# Altium schematic sheet Sheet5.SchDoc
size A4
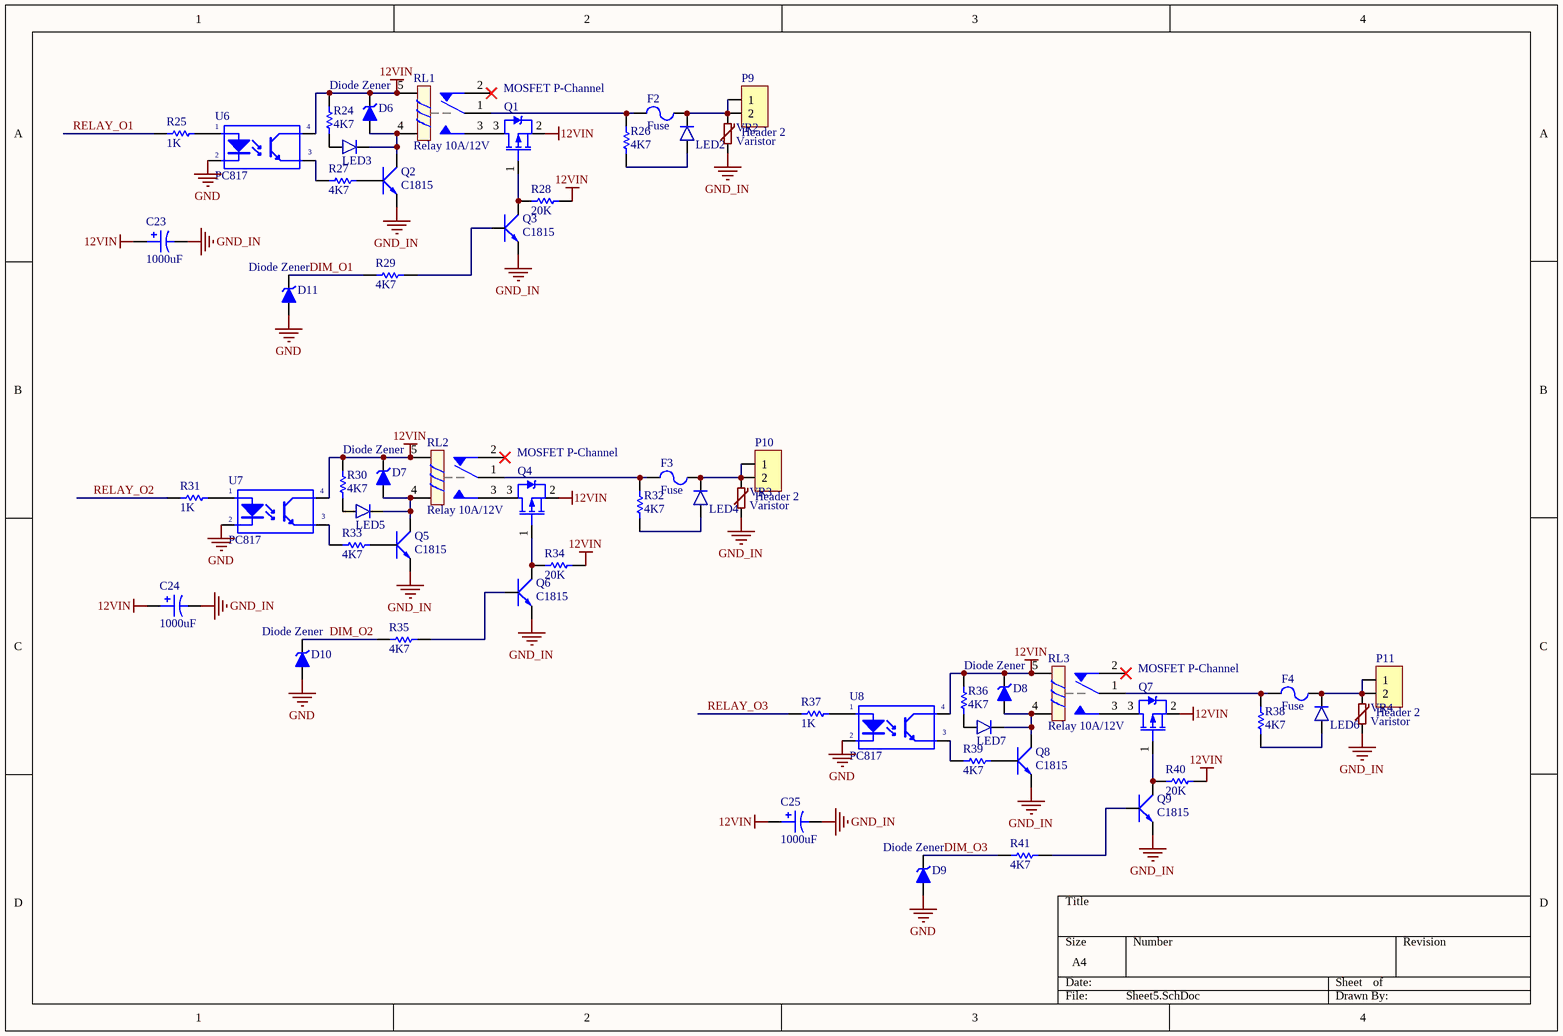
[diagram p0: Sheet5.SchDoc]

## Parts
C23  value 1000uF  [RADIAL E]  (hidden comment: Cap Pol)
C24  value 1000uF  [RADIAL E]  (hidden comment: Cap Pol)
C25  value 1000uF  [RADIAL E]  (hidden comment: Cap Pol)
D6  Diode Zener  [SOD-80]
D7  Diode Zener  [SOD-80]
D8  Diode Zener  [SOD-80]
D9  Diode Zener  [SOD-80]
D10  Diode Zener  [SOD-80]
D11  Diode Zener  [SOD-80]
F2  Fuse  [DCAR Fuse holder]
F3  Fuse  [DCAR Fuse holder]
F4  Fuse  [DCAR Fuse holder]
LED2  Led  [Led SMD 0805]  (value not drawn)
LED3  Led  [Led SMD 0805]  (value not drawn)
LED4  Led  [Led SMD 0805]  (value not drawn)
LED5  Led  [Led SMD 0805]  (value not drawn)
LED6  Led  [Led SMD 0805]  (value not drawn)
LED7  Led  [Led SMD 0805]  (value not drawn)
P9  Header 2  [HDR Domino 2]
P10  Header 2  [HDR Domino 2]
P11  Header 2  [HDR Domino 2]
Q1  MOSFET P-Channel  [TO-252 (DPAK)]
Q2  C1815  [SOT23B]
Q3  C1815  [SOT23B]
Q4  MOSFET P-Channel  [TO-252 (DPAK)]
Q5  C1815  [SOT23B]
Q6  C1815  [SOT23B]
Q7  MOSFET P-Channel  [TO-252 (DPAK)]
Q8  C1815  [SOT23B]
Q9  C1815  [SOT23B]
R24  4K7  [R 0805 (2012)]
R25  1K  [R 0805 (2012)]
R26  4K7  [R 0805 (2012)]
R27  4K7  [R 0805 (2012)]
R28  20K  [R 0805 (2012)]
R29  4K7  [R 0805 (2012)]
R30  4K7  [R 0805 (2012)]
R31  1K  [R 0805 (2012)]
R32  4K7  [R 0805 (2012)]
R33  4K7  [R 0805 (2012)]
R34  20K  [R 0805 (2012)]
R35  4K7  [R 0805 (2012)]
R36  4K7  [R 0805 (2012)]
R37  1K  [R 0805 (2012)]
R38  4K7  [R 0805 (2012)]
R39  4K7  [R 0805 (2012)]
R40  20K  [R 0805 (2012)]
R41  4K7  [R 0805 (2012)]
RL1  Relay 10A/12V  [RL_SPDT_10A]
RL2  Relay 10A/12V  [RL_SPDT_10A]
RL3  Relay 10A/12V  [RL_SPDT_10A]
U6  PC817  [SOP4 - PC817]
U7  PC817  [SOP4 - PC817]
U8  PC817  [SOP4 - PC817]
VR2  Varistor  [VARISTOR DISC 5MM/7MM]
VR3  Varistor  [VARISTOR DISC 5MM/7MM]
VR4  Varistor  [VARISTOR DISC 5MM/7MM]

## Nets
12VIN: C23.1 C24.1 C25.1 D6.2(K) D7.2(K) D8.2(K) Q1.2(S) Q4.2(S) Q7.2(S) R24.2 R28.2 R30.2 R34.2 R36.2 R40.2 RL1.5 RL2.5 RL3.5 U6.4(C) U7.4(C) U8.4(C)
GND: D9.1(A) D10.1(A) D11.1(A) U6.2(K) U7.2(K) U8.2(K)
GND_IN: C23.2 C24.2 C25.2 Q2.1(E) Q3.1(E) Q5.1(E) Q6.1(E) Q8.1(E) Q9.1(E) VR2.1 VR3.1 VR4.1
DIM_O1: D11.2(K) R29.1
DIM_O2: D10.2(K) R35.1
DIM_O3: D9.2(K) R41.1
RELAY_O1: R25.2
RELAY_O2: R31.2
RELAY_O3: R37.2
NetD6_1: D6.1(A) LED3.2(K) Q2.2(C) RL1.4
NetD7_1: D7.1(A) LED5.2(K) Q5.2(C) RL2.4
NetD8_1: D8.1(A) LED7.2(K) Q8.2(C) RL3.4
NetF2_1: F2.1 R26.2 RL1.1
NetF2_2: F2.2 LED2.2(K) P9.1 P9.2 VR2.2
NetF3_1: F3.1 R32.2 RL2.1
NetF3_2: F3.2 LED4.2(K) P10.1 P10.2 VR3.2
NetF4_1: F4.1 R38.2 RL3.1
NetF4_2: F4.2 LED6.2(K) P11.1 P11.2 VR4.2
NetLED2_1: LED2.1(A) R26.1
NetLED3_1: LED3.1(A) R24.1
NetLED4_1: LED4.1(A) R32.1
NetLED5_1: LED5.1(A) R30.1
NetLED6_1: LED6.1(A) R38.1
NetLED7_1: LED7.1(A) R36.1
NetQ1_1: Q1.1(G) Q3.2(C) R28.1
NetQ1_3: Q1.3(D) RL1.3
NetQ2_3: Q2.3(B) R27.2
NetQ3_3: Q3.3(B) R29.2
NetQ4_1: Q4.1(G) Q6.2(C) R34.1
NetQ4_3: Q4.3(D) RL2.3
NetQ5_3: Q5.3(B) R33.2
NetQ6_3: Q6.3(B) R35.2
NetQ7_1: Q7.1(G) Q9.2(C) R40.1
NetQ7_3: Q7.3(D) RL3.3
NetQ8_3: Q8.3(B) R39.2
NetQ9_3: Q9.3(B) R41.2
NetR25_1: R25.1 U6.1(A)
NetR27_1: R27.1 U6.3(E)
NetR31_1: R31.1 U7.1(A)
NetR33_1: R33.1 U7.3(E)
NetR37_1: R37.1 U8.1(A)
NetR39_1: R39.1 U8.3(E)

Not connected (* = marked no-connect by the designer): RL1 2*; RL2 2*; RL3 2*

## Library data of the parts
C23-C25 = Cap Pol: Polarized Capacitor; Published: 8-Jun-2000; LatestRevisionDate: 17-Jul-2002; LatestRevisionNote: Re-released for DXP Platform.; PackageReference: POLAR0.8; Publisher: Altium Limited
D6-D11 = Diode Zener: Zener Diode; Published: 8-Jun-2000; LatestRevisionDate: 17-Jul-2002; LatestRevisionNote: Re-released for DXP Platform.; PackageReference: DIODE-0.7; Publisher: Altium Limited
LED2-LED7 = Led: Typical LED
P9-P11 = Header 2: Header, 2-Pin; LatestRevisionDate: 17-Jul-2002; LatestRevisionNote: Re-released for DXP Platform.; Publisher: Altium Limited
Q1 Q4 Q7 = MOSFET P-Channel: pin to pad: 2>3 3>2
Q2 Q3 Q5 Q6 Q8 Q9 = C1815: NPN 600mW, ECB; Value: C1815
R24-R41 = Resistor: Published: 8-Jun-2000; LatestRevisionDate: 17-Jul-2002; LatestRevisionNote: Re-released for DXP Platform.; PackageReference: AXIAL-0.3; Publisher: Altium Limited
RL1-RL3 = Relay 1: Relay SPDT,10A - 12VDC 5 Pin; Value: Relay SPDT, 10A, 12V
U6-U8 = PC817: Single Opto; Value: PC817